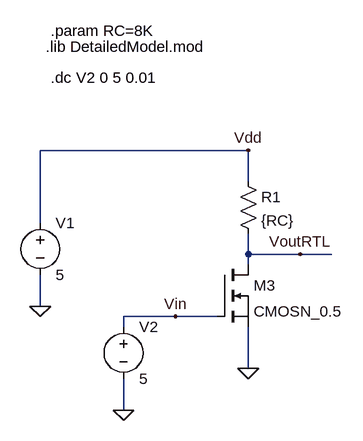
[diagram p0: schematic rtl_inverter.asc]
rtl_inverter.asc, the LTspice schematic file:
Version 4
SHEET 1 880 680
WIRE 112 -16 -208 -16
WIRE 112 32 112 -16
WIRE -208 96 -208 -16
WIRE 112 144 112 112
WIRE 192 144 112 144
WIRE 240 144 192 144
WIRE 112 160 112 144
WIRE -208 224 -208 176
WIRE 0 240 -80 240
WIRE 64 240 0 240
WIRE -80 256 -80 240
WIRE 112 320 112 256
WIRE -80 384 -80 336
FLAG -208 224 0
FLAG -80 384 0
FLAG 112 320 0
FLAG 112 -16 Vdd
FLAG 0 240 Vin
FLAG 192 144 VoutRTL
SYMBOL voltage -208 80 R0
SYMATTR InstName V1
SYMATTR Value 5
SYMBOL nmos 64 160 R0
SYMATTR InstName M3
SYMATTR Value CMOSN_0.5
SYMBOL res 96 16 R0
SYMATTR InstName R1
SYMATTR Value {RC}
SYMBOL voltage -80 240 R0
WINDOW 123 0 0 Left 0
WINDOW 39 0 0 Left 0
SYMATTR InstName V2
SYMATTR Value 5
TEXT -200 -176 Left 2 !.lib DetailedModel.mod
TEXT -192 -128 Left 2 !.dc V2 0 5 0.01
TEXT -192 -200 Left 2 !.param RC=8K

The netlist it stands for:
* rtl_inverter.asc
V1 Vdd 0 5
M3 VoutRTL Vin 0 0 CMOSN_0.5
R1 Vdd VoutRTL {RC}
V2 Vin 0 5
.model NMOS NMOS
.model PMOS PMOS
.lib standard.mos
.lib DetailedModel.mod
.dc V2 0 5 0.01
.param RC=8K
.backanno
.end

* Results of the author's LTspice run, read from the files saved beside the schematic
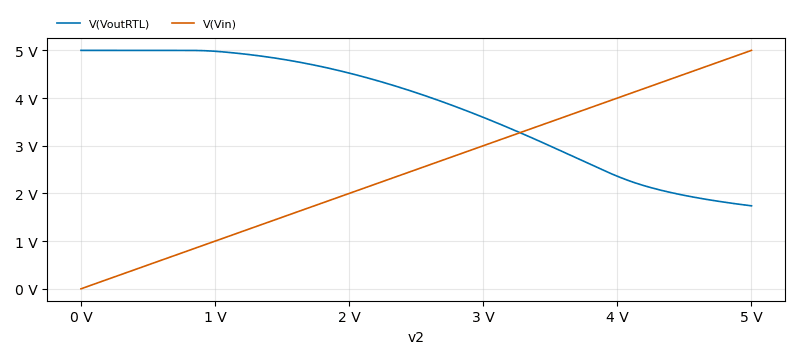
[diagram p1: DC transfer characteristic of rtl_inverter.asc, plotted from the saved traces]
* DC transfer characteristic, 1 run:
*   V(VoutRTL): 5 V at v2=0 V, 1.74 V at v2=5 V, min 1.74 V, max 5 V
*   V(Vin): 0 V at v2=0 V, 5 V at v2=5 V, min 0 V, max 5 V